# Altium project CHILD_BOARD.PrjPcb (part 2 of 2)

## Sheet PWR_MGMT.SchDoc
size C; SheetNumber: 7; SheetTotal: 12
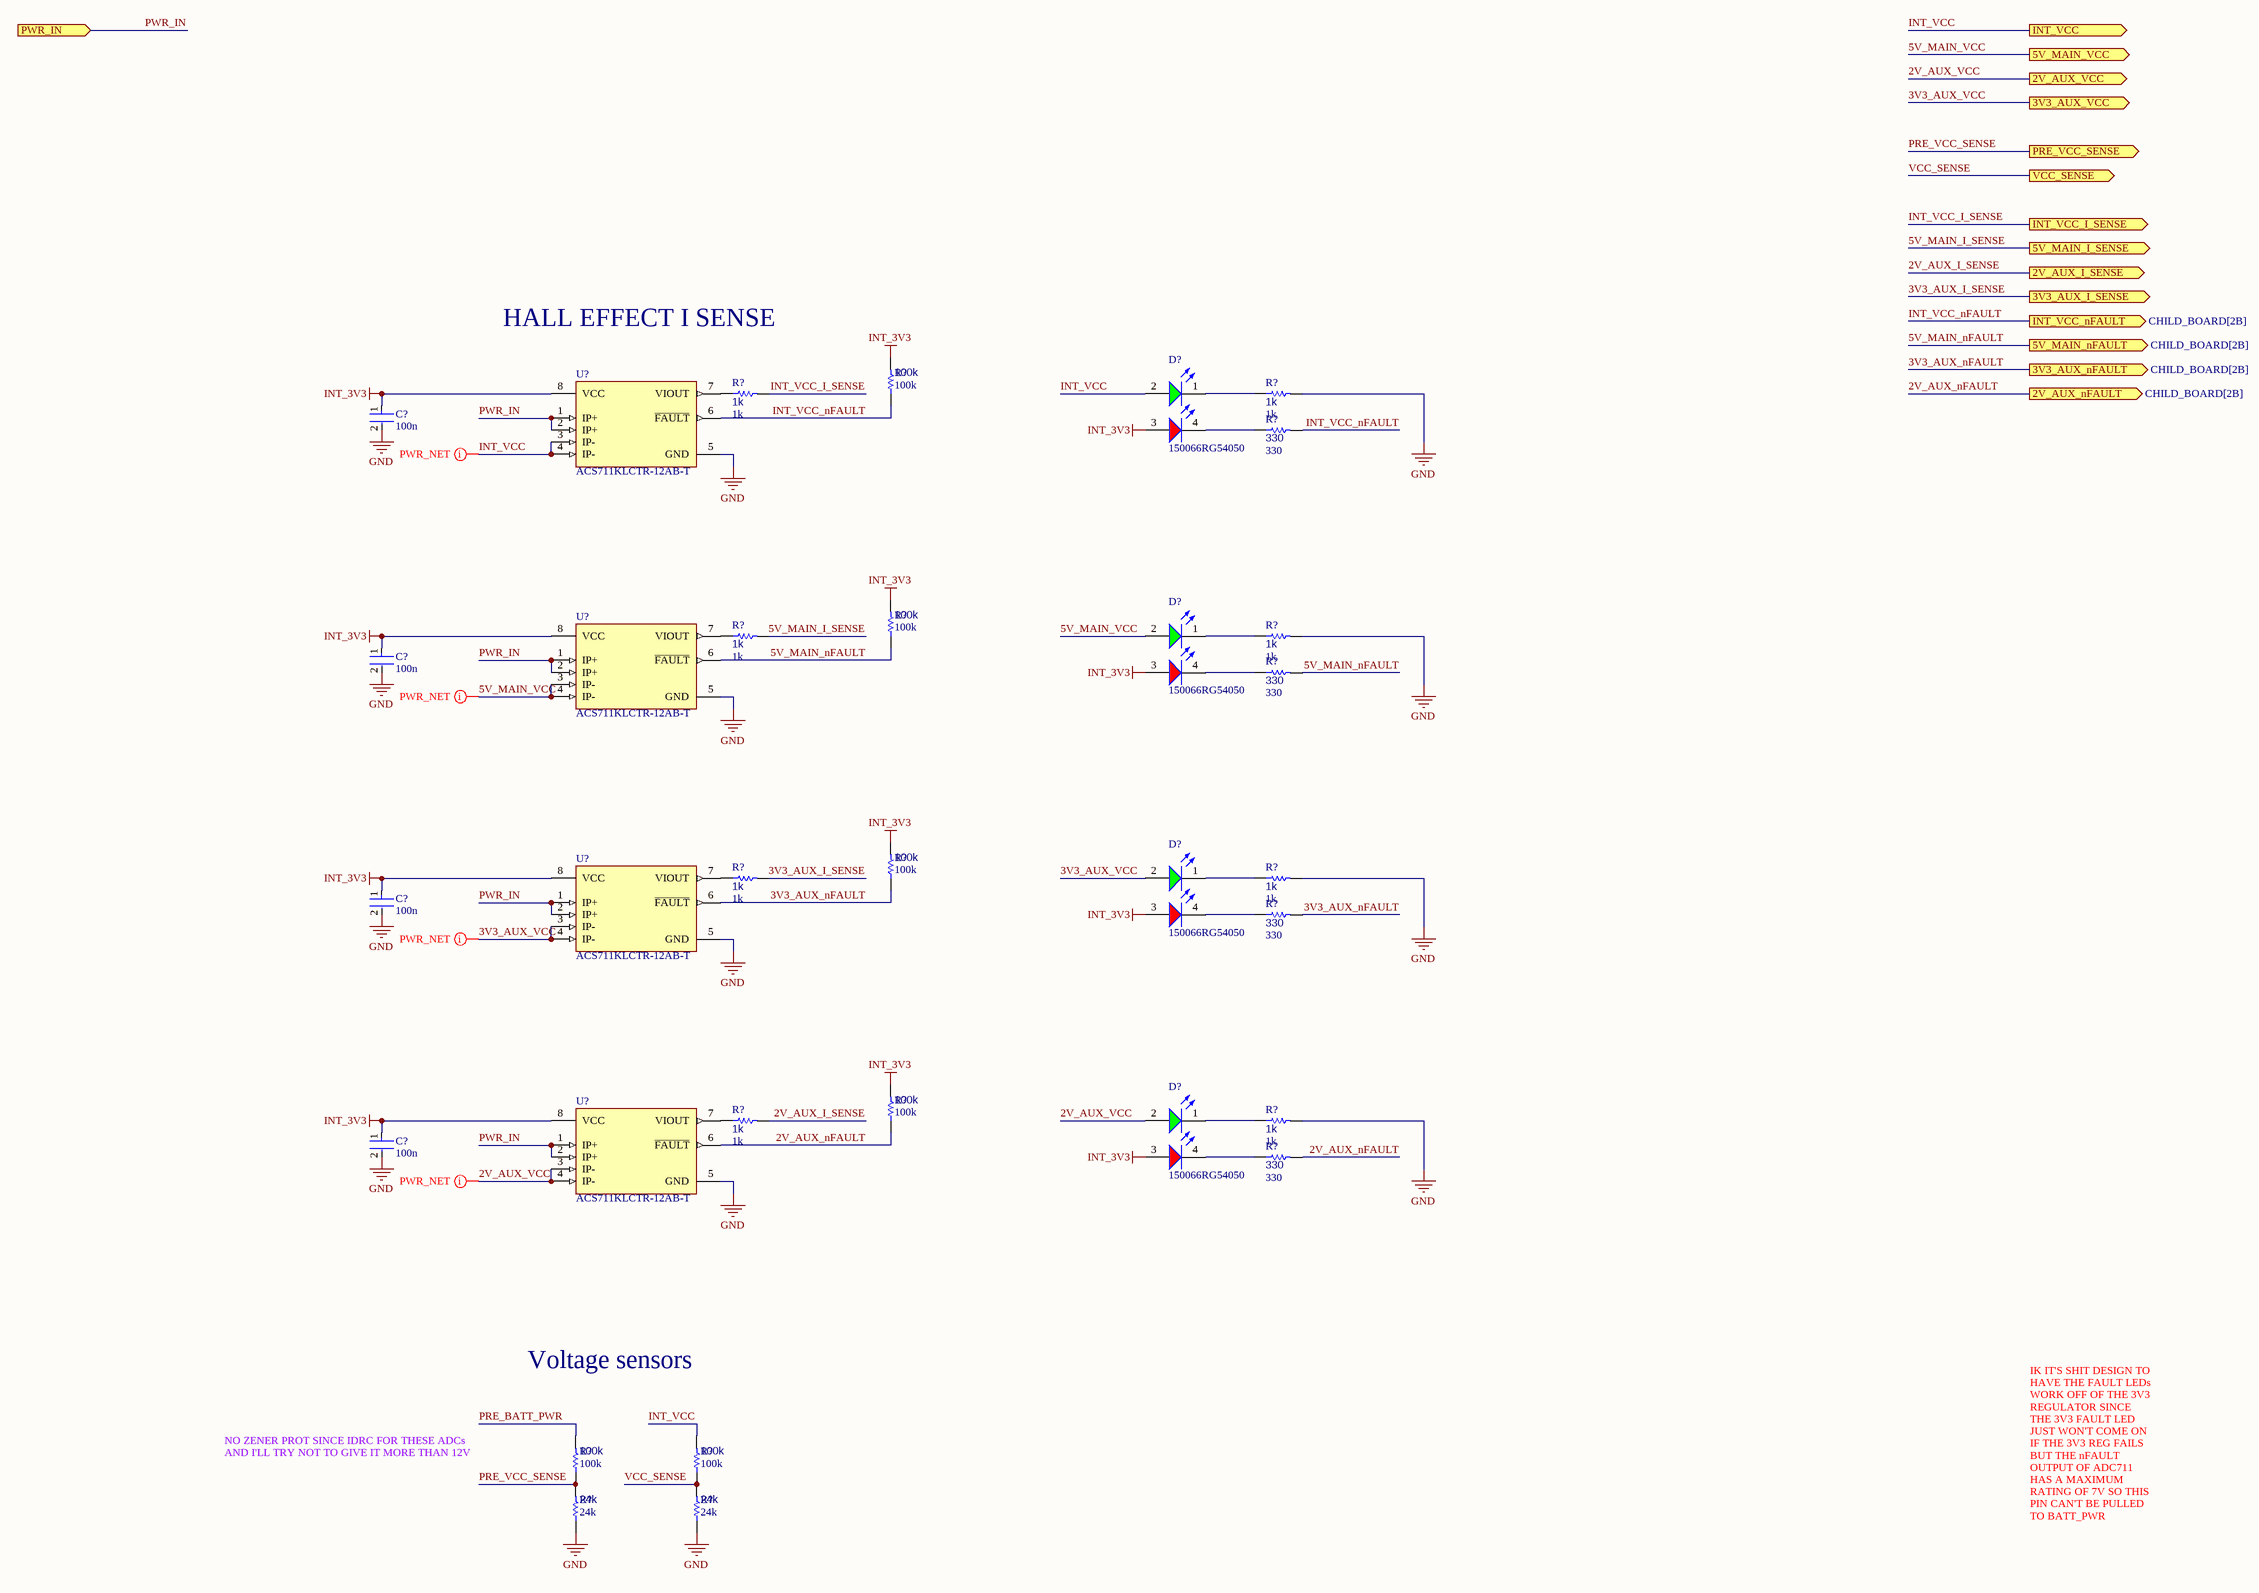
[diagram p9: PWR_MGMT.SchDoc]

### Parts
(Parts that share a designator on the sheet are numbered #1, #2 ... from top to bottom, then left to right.)
C?#21  100n  [FP-0402-L_1_0_0_05-W_0_5-IPC_A]
C?#22  100n  [FP-0402-L_1_0_0_05-W_0_5-IPC_A]
C?#23  100n  [FP-0402-L_1_0_0_05-W_0_5-IPC_A]
C?#24  100n  [FP-0402-L_1_0_0_05-W_0_5-IPC_A]
D?#1  150066RG54050  [WL-SBCD_0606]
D?#2  150066RG54050  [WL-SBCD_0606]
D?#3  150066RG54050  [WL-SBCD_0606]
D?#4  150066RG54050  [WL-SBCD_0606]
R?#17  100k  [R0603B]
R?#18  1k  [R0603B]
R?#19  1k  [R0603B]
R?#20  330  [R0603B]
R?#21  100k  [R0603B]
R?#22  1k  [R0603B]
R?#23  1k  [R0603B]
R?#24  330  [R0603B]
R?#25  100k  [R0603B]
R?#26  1k  [R0603B]
R?#27  1k  [R0603B]
R?#28  330  [R0603B]
R?#29  100k  [R0603B]
R?#30  1k  [R0603B]
R?#31  1k  [R0603B]
R?#32  330  [R0603B]
R?#33  100k  [R0603B]
R?#34  100k  [R0603B]
R?#35  24k  [R0603B]
R?#36  24k  [R0603B]
U?#3  ACS711KLCTR-12AB-T  [FP-LC-8-IPC_C]
U?#4  ACS711KLCTR-12AB-T  [FP-LC-8-IPC_C]
U?#5  ACS711KLCTR-12AB-T  [FP-LC-8-IPC_C]
U?#6  ACS711KLCTR-12AB-T  [FP-LC-8-IPC_C]

### Ports
2V_AUX_I_SENSE (out, see CHILD_BOARD[2B]), 2V_AUX_nFAULT (out, see CHILD_BOARD[2B]), 2V_AUX_VCC (out, see CHILD_BOARD[2B]), 3V3_AUX_I_SENSE (out, see CHILD_BOARD[2B]), 3V3_AUX_nFAULT (out, see CHILD_BOARD[2B]), 3V3_AUX_VCC (out, see CHILD_BOARD[2B]), 5V_MAIN_I_SENSE (out, see CHILD_BOARD[2B]), 5V_MAIN_nFAULT (out, see CHILD_BOARD[2B]), 5V_MAIN_VCC (out, see CHILD_BOARD[2A]), INT_VCC (out, see CHILD_BOARD[2A]), INT_VCC_I_SENSE (out, see CHILD_BOARD[2B]), INT_VCC_nFAULT (out, see CHILD_BOARD[2B]), PRE_VCC_SENSE (out, see CHILD_BOARD[2B]), PWR_IN (in, see CHILD_BOARD[2A], INT_REG[1A]), VCC_SENSE (out, see CHILD_BOARD[2B])

### Nets
GND: C?#21.2 C?#22.2 C?#23.2 C?#24.2 R?#19.2 R?#23.2 R?#27.2 R?#31.2 R?#35.1 R?#36.1 U?#3.5(GND) U?#4.5(GND) U?#5.5(GND) U?#6.5(GND)
INT_3V3: C?#21.1 C?#22.1 C?#23.1 C?#24.1 D?#1.3(A) D?#2.3(A) D?#3.3(A) D?#4.3(A) R?#17.2 R?#21.2 R?#25.2 R?#29.2 U?#3.8(VCC) U?#4.8(VCC) U?#5.8(VCC) U?#6.8(VCC)
2V_AUX_I_SENSE: R?#30.2 ; port 2V_AUX_I_SENSE
2V_AUX_nFAULT: R?#29.1 R?#32.2 U?#6.6(~{FAULT}) ; port 2V_AUX_nFAULT
2V_AUX_VCC: D?#4.2(A) U?#6.3(IP-) U?#6.4(IP-) ; port 2V_AUX_VCC
3V3_AUX_I_SENSE: R?#26.2 ; port 3V3_AUX_I_SENSE
3V3_AUX_nFAULT: R?#25.1 R?#28.2 U?#5.6(~{FAULT}) ; port 3V3_AUX_nFAULT
3V3_AUX_VCC: D?#3.2(A) U?#5.3(IP-) U?#5.4(IP-) ; port 3V3_AUX_VCC
5V_MAIN_I_SENSE: R?#22.2 ; port 5V_MAIN_I_SENSE
5V_MAIN_nFAULT: R?#21.1 R?#24.2 U?#4.6(~{FAULT}) ; port 5V_MAIN_nFAULT
5V_MAIN_VCC: D?#2.2(A) U?#4.3(IP-) U?#4.4(IP-) ; port 5V_MAIN_VCC
INT_VCC: D?#1.2(A) R?#34.2 U?#3.3(IP-) U?#3.4(IP-) ; port INT_VCC
INT_VCC_I_SENSE: R?#18.2 ; port INT_VCC_I_SENSE
INT_VCC_nFAULT: R?#17.1 R?#20.2 U?#3.6(~{FAULT}) ; port INT_VCC_nFAULT
PRE_BATT_PWR: R?#33.2
PRE_VCC_SENSE: R?#33.1 R?#35.2 ; port PRE_VCC_SENSE
PWR_IN: U?#3.1(IP+) U?#3.2(IP+) U?#4.1(IP+) U?#4.2(IP+) U?#5.1(IP+) U?#5.2(IP+) U?#6.1(IP+) U?#6.2(IP+) ; port PWR_IN
VCC_SENSE: R?#34.1 R?#36.2 ; port VCC_SENSE
NetD?#1_1: D?#1.1(K) R?#19.1
NetD?#1_4: D?#1.4(K) R?#20.1
NetD?#2_1: D?#2.1(K) R?#23.1
NetD?#2_4: D?#2.4(K) R?#24.1
NetD?#3_1: D?#3.1(K) R?#27.1
NetD?#3_4: D?#3.4(K) R?#28.1
NetD?#4_1: D?#4.1(K) R?#31.1
NetD?#4_4: D?#4.4(K) R?#32.1
NetR?#18_1: R?#18.1 U?#3.7(VIOUT)
NetR?#22_1: R?#22.1 U?#4.7(VIOUT)
NetR?#26_1: R?#26.1 U?#5.7(VIOUT)
NetR?#30_1: R?#30.1 U?#6.7(VIOUT)

### Layout directives
net class PWR: 2V_AUX_VCC, 3V3_AUX_VCC, 5V_MAIN_VCC, INT_VCC

### Notes on the sheet
- HALL EFFECT I SENSE
- Voltage sensors
- NO ZENER PROT SINCE IDRC FOR THESE ADCs
- AND I'LL TRY NOT TO GIVE IT MORE THAN 12V
- IK IT'S SHIT DESIGN TO HAVE THE FAULT LEDs WORK OFF OF THE 3V3 REGULATOR SINCE THE 3V3 FAULT LED JUST WON'T COME ON IF THE 3V3 REG FAILS BUT THE nFAULT OUTPUT OF ADC711 HAS A MAXIMUM RATING OF 7V SO THIS PIN CAN'T BE PULLED TO BATT_PWR

### Library data of the parts
C?#21-C?#24 = CMP-001-00058-1: LARGE PADS, 0402 CAP, CHANGE COMMENT TO MATCH REAL P/N; Capacitor Type: Ceramic; Min Operating Temperature: -55°C; Mounting Technology: Surface Mount; Pins: 2; Case/Package: 0402; RoHS Compliant: Yes; Max Operating Temperature: 85°C
D?#1-D?#4 = CMP-004-00040-2: Led, Red/Grn, 180Mcd/230Mcd, 624Nm/525Nm Rohs Compliant: Yes; Source: rgled.SchLib; Component Type: Standard; Design Item ID: CMP-004-00034-2; Pins: 4
R?#17-R?#36 = CMP-009-00002-14: Resistor
  R?#17 R?#21 R?#25 R?#29 R?#33 R?#34: Value: 100k
  R?#18 R?#19 R?#22 R?#23 R?#26 R?#27 R?#30 R?#31: Value: 1k
  R?#20 R?#24 R?#28 R?#32: Value: 330
  R?#35 R?#36: Value: 24k
U?#3-U?#6 = CMP-1557-00012-2: SENSOR CURRENT HALL 12.5A AC/DC; Number of Channels: 1; Min Supply Voltage: 3V; Sensitivity: 110mV/A; Response Time: 4.6us; Operating Supply Voltage: 3.3V; Max Supply Voltage: 5.5V; Max Supply Current: 5.5mA; Bandwidth: 100kHz; Linearity: 1%; Quiescent Current: 4mA; Accuracy: 5%; Polarity: Bidirectional; Case/Package: SOIC; Packaging: Tape and Reel; Number of Pins: 8; Width: 3.9mm; Frequency: 100kHz; -3db Bandwidth: 100kHz; REACH SVHC: No SVHC; Series: -; Height: 1.5mm; Package Quantity: 1; Min Operating Temperature: -40°C; Max Operating Temperature: 125°C; Current Sensing: 12.5A; RoHS Compliant: Yes; Length: 4.9mm

## Nets that join several sheets
3V3_INT: PWR_PROT_0 (C?_PWR_PROT_0.1 R?_PWR_PROT_0#2.2 U?_PWR_PROT_0.8), INT_REG (C?#14.1 R?#12.1 U?#2.2 U?#2.4), PWR_PROT_1 (C?_PWR_PROT_1.1 R?_PWR_PROT_1#2.2 U?_PWR_PROT_1.8), PWR_PROT_2 (C?_PWR_PROT_2.1 R?_PWR_PROT_2#2.2 U?_PWR_PROT_2.8), PWR_PROT_3 (C?_PWR_PROT_3.1 R?_PWR_PROT_3#2.2 U?_PWR_PROT_3.8), PWR_PROT_4 (C?_PWR_PROT_4.1 R?_PWR_PROT_4#2.2 U?_PWR_PROT_4.8), PWR_PROT_5 (C?_PWR_PROT_5.1 R?_PWR_PROT_5#2.2 U?_PWR_PROT_5.8)
GND: CHILD_BOARD (9 pins), TCAN1146_PWR_MGMT (15 pins), PWR_PROT_0 (C?_PWR_PROT_0.2 D?_PWR_PROT_0.2 R?_PWR_PROT_0#4.1 U?_PWR_PROT_0.5), REG_0 (13 pins), REG_1 (13 pins), JETSON_RAW_PWR_FILTER (9 pins), 2V_REG (16 pins), INT_REG (8 pins), PWR_PROT_1 (C?_PWR_PROT_1.2 D?_PWR_PROT_1.2 R?_PWR_PROT_1#4.1 U?_PWR_PROT_1.5), PWR_PROT_2 (C?_PWR_PROT_2.2 D?_PWR_PROT_2.2 R?_PWR_PROT_2#4.1 U?_PWR_PROT_2.5), PWR_PROT_3 (C?_PWR_PROT_3.2 D?_PWR_PROT_3.2 R?_PWR_PROT_3#4.1 U?_PWR_PROT_3.5), PWR_PROT_4 (C?_PWR_PROT_4.2 D?_PWR_PROT_4.2 R?_PWR_PROT_4#4.1 U?_PWR_PROT_4.5), PWR_PROT_5 (C?_PWR_PROT_5.2 D?_PWR_PROT_5.2 R?_PWR_PROT_5#4.1 U?_PWR_PROT_5.5), ADC (11 pins), PWR_MGMT (14 pins)
INT_3V3: TCAN1146_PWR_MGMT (5 pins), REG_0 (R17_REG_0.1), REG_1 (R17_REG_1.1), 2V_REG (R?#7.2), ADC (6 pins), PWR_MGMT (16 pins)
PWR_OUT: TCAN1146_PWR_MGMT (U7.3 U7.4), PWR_PROT_0 (F?_PWR_PROT_0.1), INT_REG (C?#11.1 C?#13.1 U?#1.3 U?#2.3), PWR_PROT_1 (F?_PWR_PROT_1.1), PWR_PROT_2 (F?_PWR_PROT_2.1), PWR_PROT_3 (F?_PWR_PROT_3.1), PWR_PROT_4 (F?_PWR_PROT_4.1), PWR_PROT_5 (F?_PWR_PROT_5.1)
CAN_N: CHILD_BOARD (J1.8), TCAN1146_PWR_MGMT (5 pins)
CAN_P: CHILD_BOARD (J1.7), TCAN1146_PWR_MGMT (5 pins)
NetC?#1_1: PWR_PROT_0 (R?_PWR_PROT_0#3.2 U?_PWR_PROT_0.3 U?_PWR_PROT_0.4), JETSON_RAW_PWR_FILTER (C?#1.1 C?#2.1 C?#9.1 L?.1)
PWR_IN: REG_0 (C20_REG_0.2 C21_REG_0.2 C22_REG_0.2 U3_REG_0.2), PWR_PROT_1 (R?_PWR_PROT_1#3.2 U?_PWR_PROT_1.3 U?_PWR_PROT_1.4)
PWR_IN: REG_1 (C20_REG_1.2 C21_REG_1.2 C22_REG_1.2 U3_REG_1.2), PWR_PROT_2 (R?_PWR_PROT_2#3.2 U?_PWR_PROT_2.3 U?_PWR_PROT_2.4)
PWR_IN: 2V_REG (C141.2 C142.2 C143.2 U13.2), PWR_PROT_5 (R?_PWR_PROT_5#3.2 U?_PWR_PROT_5.3 U?_PWR_PROT_5.4)